# Altium schematic sheet SheetMicrocontroller.SchDoc
size A3; DocumentNumber: 3; SheetNumber: 3; SheetTotal: 5
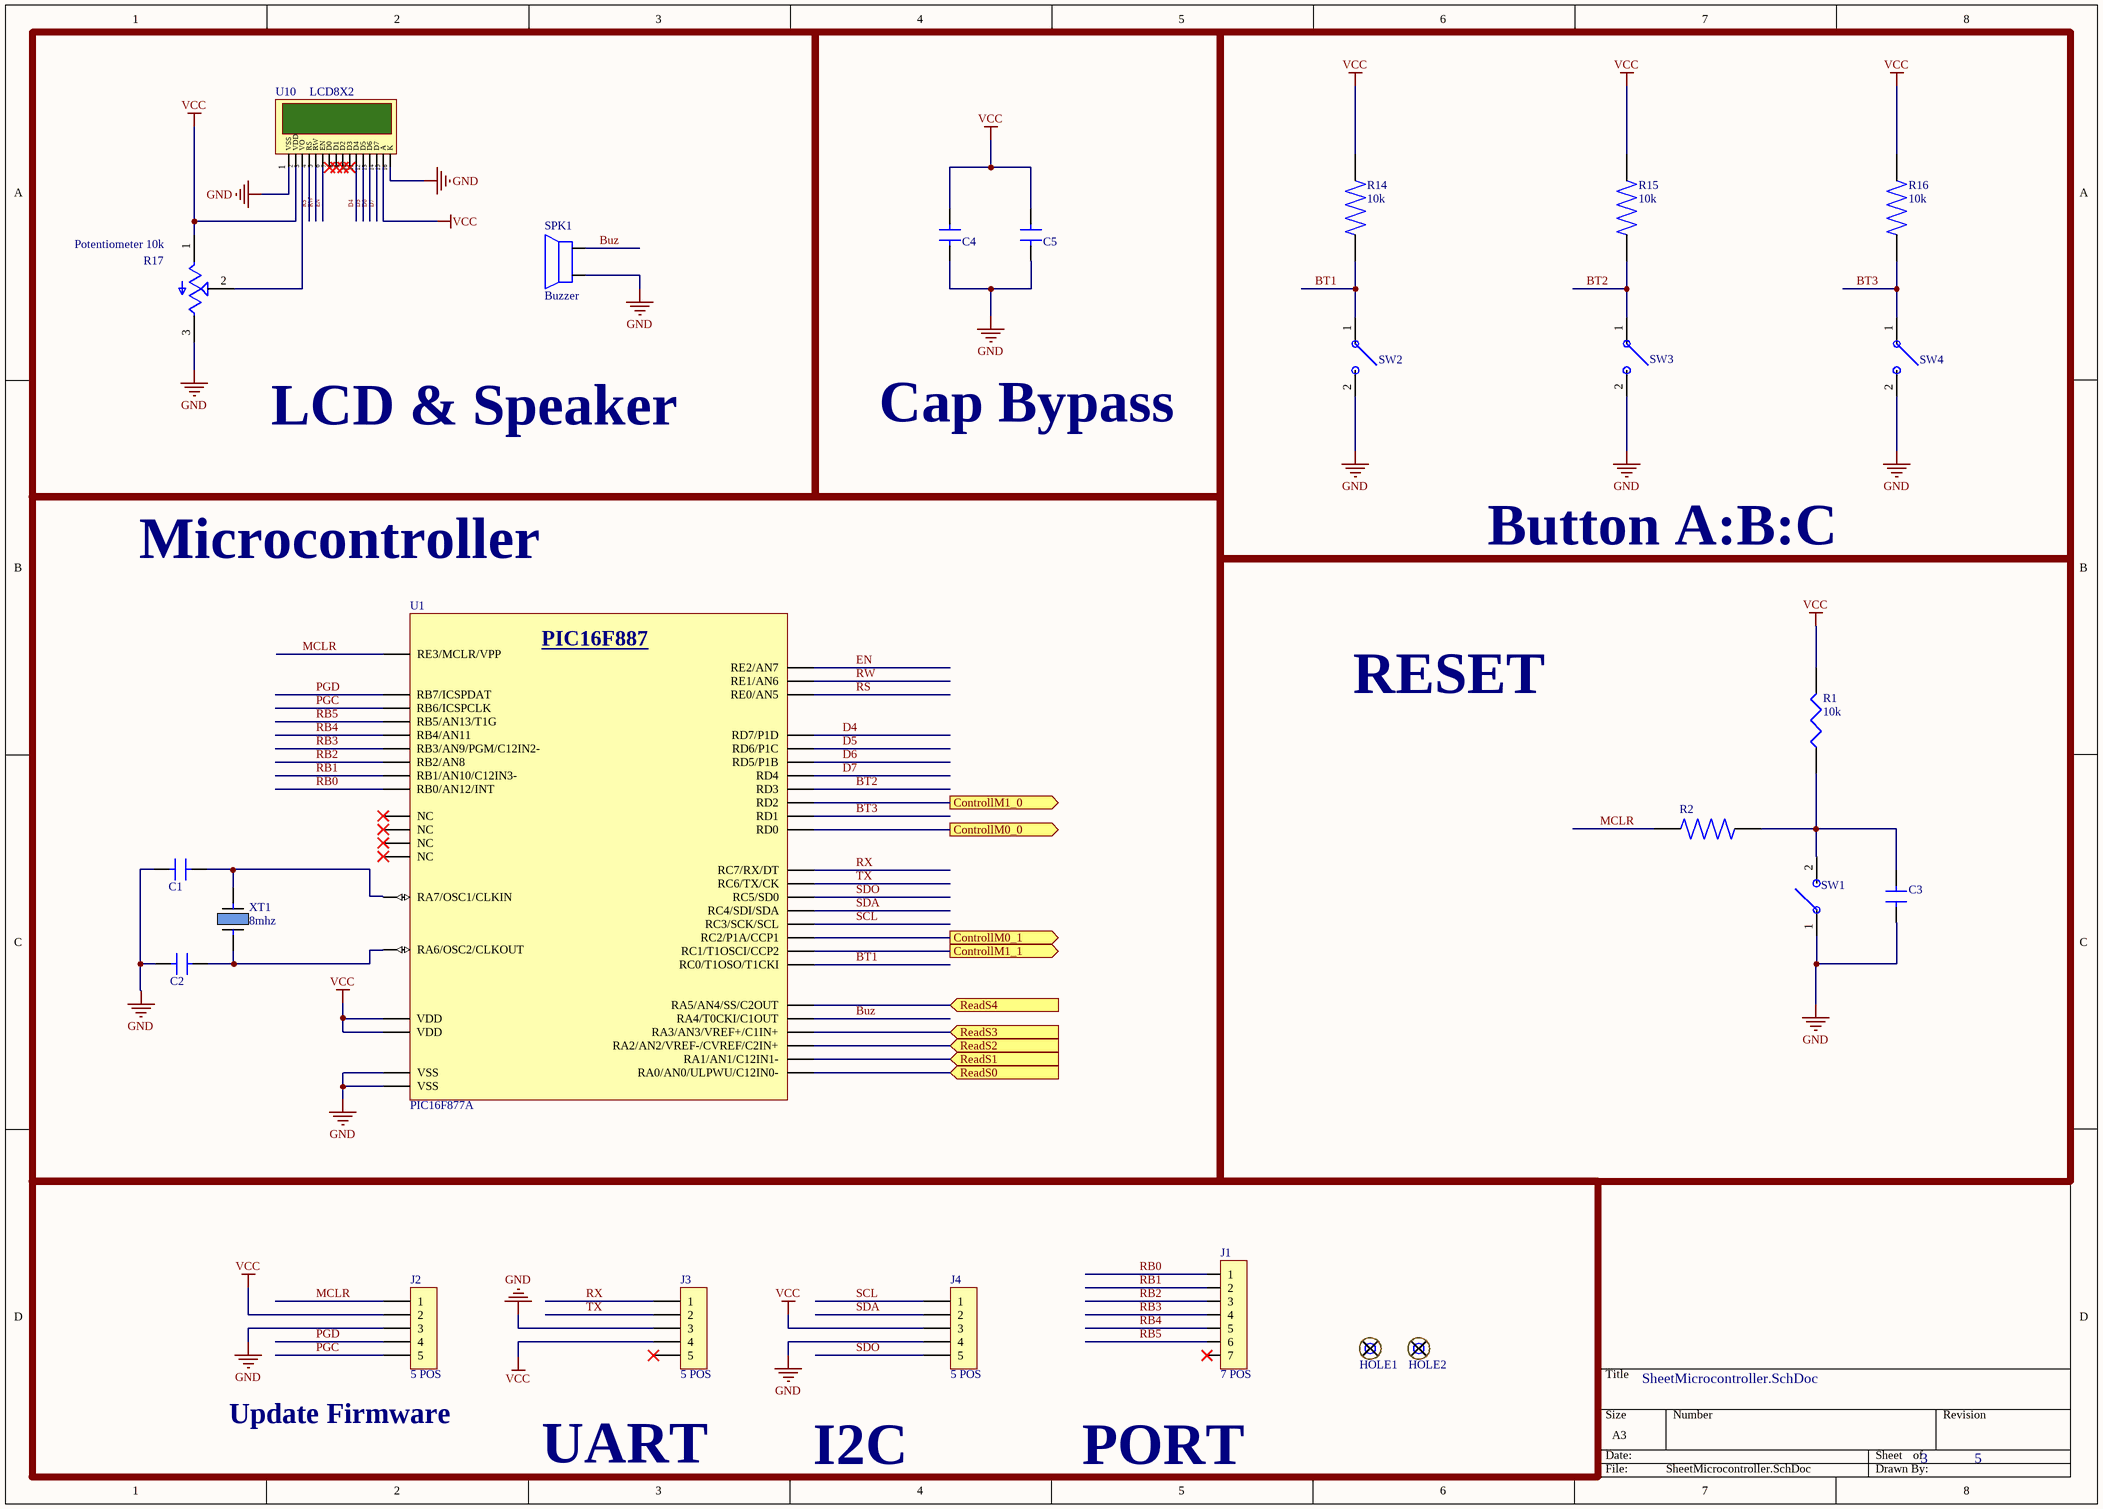
[diagram p0: SheetMicrocontroller.SchDoc]

## Parts
C1  30PF 50V  [C0805 30PF 50V]  (value not drawn)
C2  30PF 50V  [C0805 30PF 50V]  (value not drawn)
C3  C0805C104K5RACTU  [CAP104 0.1UF 50V]  (value not drawn)
C4  C0805C104K5RACTU  [CAP104 0.1UF 50V]  (value not drawn)
C5  C0805C104K5RACTU  [CAP104 0.1UF 50V]  (value not drawn)
HOLE1  Hole  [Hole 2MM]  (value not drawn)
HOLE2  Hole  [Hole 2MM]  (value not drawn)
J1  7 POS  [CONN HEADER VERT 7POS 2.54MM]
J2  5 POS  [CONN HEADER VERT 5POS 2.54MM]
J3  5 POS  [CONN HEADER VERT 5POS 2.54MM]
J4  5 POS  [CONN HEADER VERT 5POS 2.54MM]
R1  10k  [RC0805 10K OHM 1% 1/8W]
R2  RC0805JR-07470RL  [RC0805JR-07470RL]  (value not drawn)
R14  10k  [RC0805 10K OHM 1% 1/8W]
R15  10k  [RC0805 10K OHM 1% 1/8W]
R16  10k  [RC0805 10K OHM 1% 1/8W]
R17  Potentiometer 10k  [TRIM_TC33X-2-103E]
SPK1  Buzzer  [BUZZER]
SW1  PTS636SM43JSMTRLFS  [PTS636 SM43J SMTR LFS]  (value not drawn)
SW2  PTS636SM43JSMTRLFS  [PTS636 SM43J SMTR LFS]  (value not drawn)
SW3  PTS636SM43JSMTRLFS  [PTS636 SM43J SMTR LFS]  (value not drawn)
SW4  PTS636SM43JSMTRLFS  [PTS636 SM43J SMTR LFS]  (value not drawn)
U1  PIC16F877A  [TQFP80P1200X1200X120-44N]
U10  LCD8X2  [LCD0802]
XT1  8mhz  [CAPAE13348X42M]

## Blocks framed on the sheet
LCD & Speaker: R17 SPK1 U10
Cap Bypass: C4 C5
Button A:B:C: R14-R16 SW2-SW4
Microcontroller: C1 C2 U1 XT1
RESET: C3 R1 R2 SW1

## Ports
ControllM0_0 (out), ControllM0_1 (out), ControllM1_0 (out), ControllM1_1 (out), ReadS0 (in), ReadS1 (in), ReadS2 (in), ReadS3 (in), ReadS4 (in)

## Nets
GND: C1.1 C2.1 C3.1 C4.1 C5.1 J2.3 J3.3 J4.4 R17.3(CW) SPK1.2 SW1.1 SW2.2 SW3.2 SW4.2 U1.6(VSS) U1.29(VSS) U10.1(VSS) U10.16(K)
VCC: C4.2 C5.2 J2.2 J3.4 J4.3 R1.2 R14.2 R15.2 R16.2 R17.1(CCW) U1.7(VDD) U1.28(VDD) U10.2(VDD) U10.15(A)
BT1: R14.1 SW2.1 U1.32(RC0/T1OSO/T1CKI)
BT2: R15.1 SW3.1 U1.41(RD3)
BT3: R16.1 SW4.1 U1.39(RD1)
Buz: SPK1.1 U1.23(RA4/T0CKI/C1OUT)
ControllM0_0: U1.38(RD0) ; port ControllM0_0
ControllM0_1: U1.36(RC2/P1A/CCP1) ; port ControllM0_1
ControllM1_0: U1.40(RD2) ; port ControllM1_0
ControllM1_1: U1.35(RC1/T1OSCI/CCP2) ; port ControllM1_1
D4: U1.5(RD7/P1D) U10.11(D4)
D5: U1.4(RD6/P1C) U10.12(D5)
D6: U1.3(RD5/P1B) U10.13(D6)
D7: U1.2(RD4) U10.14(D7)
EN: U1.27(RE2/AN7) U10.6(EN)
MCLR: J2.1 R2.1 U1.18(RE3/MCLR/VPP)
PGC: J2.5 U1.16(RB6/ICSPCLK)
PGD: J2.4 U1.17(RB7/ICSPDAT)
RB0: J1.1 U1.8(RB0/AN12/INT)
RB1: J1.2 U1.9(RB1/AN10/C12IN3-)
RB2: J1.3 U1.10(RB2/AN8)
RB3: J1.4 U1.11(RB3/AN9/PGM/C12IN2-)
RB4: J1.5 U1.14(RB4/AN11)
RB5: J1.6 U1.15(RB5/AN13/T1G)
ReadS0: U1.19(RA0/AN0/ULPWU/C12IN0-) ; port ReadS0
ReadS1: U1.20(RA1/AN1/C12IN1-) ; port ReadS1
ReadS2: U1.21(RA2/AN2/VREF-/CVREF/C2IN+) ; port ReadS2
ReadS3: U1.22(RA3/AN3/VREF+/C1IN+) ; port ReadS3
ReadS4: U1.24(RA5/AN4/SS/C2OUT) ; port ReadS4
RS: U1.25(RE0/AN5) U10.4(RS)
RW: U1.26(RE1/AN6) U10.5(RW)
RX: J3.1 U1.1(RC7/RX/DT)
SCL: J4.1 U1.37(RC3/SCK/SCL)
SDA: J4.2 U1.42(RC4/SDI/SDA)
SDO: J4.5 U1.43(RC5/SD0)
TX: J3.2 U1.44(RC6/TX/CK)
NetC1_2: C1.2 U1.30(RA7/OSC1/CLKIN) XT1.2
NetC2_2: C2.2 U1.31(RA6/OSC2/CLKOUT) XT1.1
NetC3_2: C3.2 R1.1 R2.2 SW1.2
NetR17_2: R17.2(W) U10.3(VO)

Not connected (* = marked no-connect by the designer): J1 7*; J3 5*; U1 12(NC)* 13(NC)* 33(NC)* 34(NC)*; U10 7(D0)* 8(D1)* 9(D2)* 10(D3)*

## Notes on the sheet
- (near J2) Update Firmware
- UART
- I2C
- PORT
- (in symbol PIC16F887-I/PT) PIC16F887

## Library data of the parts
C1 C2 = C0805X300J5GAC7800: Manufacturer: KEMET; Supplier 1: Digi-Key; Manufacturer Part Number: C0805X300J5GAC7800; Stock 1: 3943; Pricing 1: 1 = 0.42000, 10 = 0.29100, 50 = 0.20380, 100 = 0.17460, 500 = 0.13098, 1000 = 0.11060 (USD); RoHS: No; Supplier Part Number 1: 399-19459-1-ND
C3-C5 = C0805C104K5RACTU: Cap Ceramic 0.1uF 50V X7R 10% SMD 2.0 x 1.2 mm 125 C Paper T/R; Manufacturer: KEMET; Capacitance: 100nF; Voltage: 500V; Supplier 1: Digi-Key; Manufacturer Part Number: C0805C104K5RACTU; Stock 1: 2487008; Pricing 1: 1 = 0.16000, 10 = 0.11500, 50 = 0.06540, 100 = 0.05420, 500 = 0.03802, 1000 = 0.03147 (USD); RoHS: Yes; Mount: Surface Mount,PCB; Case/Package: 0805; Number of Pins: 2; Dielectric Material: Ceramic; Case Code (Imperial): 0805; Case Code (Metric): 2012; Contact Plating: Tin,Matte; Min Operating Temperature: -55°C; Max Operating Temperature: 125°C; Tolerance: 10%; Packaging: Tape and Reel; Voltage Rating (DC): 50V; Dielectric: X7R; Termination: SMD/SMT; Package Quantity: 4000; Voltage Rating: 50V; Length: 2mm; Height: 0.9mm; Width: 1.2mm; Lead Pitch: 0.75mm; Depth: 1.25mm; Thickness: 0.035inch; Radiation Hardening: No; REACH SVHC: No SVHC; ComponentLink1URL: https://datasheet.ciiva.com/14589/70095383-14589048.pdf?src-supplier=Allied+Electronics; ComponentLink1Description: https://datasheet.ciiva.com/14589/70095383-14589048.pdf?src-supplier=Allied+Electronics; ComponentLink2URL: https://datasheet.ciiva.com/28682/1851736-28682232.pdf?src-supplier=Element14; ComponentLink2Description: https://datasheet.ciiva.com/28682/1851736-28682232.pdf?src-supplier=Element14; ComponentLink3URL: https://datasheet.ciiva.com/32431/slceramic-chip-condensers-e-32431755.pdf?src-supplier=Distrelec; ComponentLink3Description: https://datasheet.ciiva.com/32431/slceramic-chip-condensers-e-32431755.pdf?src-supplier=Distrelec; ComponentLink4URL: https://datasheet.ciiva.com/18410/70095383-18410815.pdf?src-supplier=Allied+Electronics; ComponentLink4Description: https://datasheet.ciiva.com/18410/70095383-18410815.pdf?src-supplier=Allied+Electronics; Supplier Part Number 1: 399-1170-1-ND
HOLE1 HOLE2 = Hole 2mm: Hole 3mm
J1 = 0022284074: Header Connector, Pcb Mount, Recept, 7 Contacts, Pin, 0.1 Pitch, Pc Tail Terminal; Manufacturer: Molex; Contact Resistance: 20mR; Number of Positions: 7; Gender: Male; Connector Type: Male Pin; Max Voltage Rating (AC): 250V; Pitch: 2.54mm; Supplier 1: Digi-Key; Manufacturer Part Number: 0022284074; Stock 1: 3294; Pricing 1: 1 = 0.63000, 10 = 0.53100, 100 = 0.41300 (USD); RoHS: Yes; Mount: Through Hole; Contact Plating: Gold; Contact Material: Bronze; Color: Black; Housing Color: Black; Housing Material: Thermoplastic; Min Operating Temperature: 0°C; Max Operating Temperature: 75°C; Number of Rows: 1; Packaging: Bulk; Termination: Solder; Number of Contacts: 7; Orientation: Straight; Package Quantity: 1; Series: KK® 42375; Contact Type: Male Pin; Length: 17.78mm; Depth: 2.49mm; Contact Mating Length: 0.32inch; RoHS Compliant: Yes; ComponentLink1URL: https://datasheet.ciiva.com/6814/022284363-sd-6814049.pdf?src-supplier=Digi-Key; ComponentLink1Description: https://datasheet.ciiva.com/6814/022284363-sd-6814049.pdf?src-supplier=Digi-Key; ComponentLink2URL: https://datasheet.ciiva.com/10087/0022284074-pcb-headers-10087690.pdf?src-supplier=Avnet; ComponentLink2Description: https://datasheet.ciiva.com/10087/0022284074-pcb-headers-10087690.pdf?src-supplier=Avnet; Supplier Part Number 1: WM50018-07-ND
J2-J4 = PRPC005SACN-RC: Conn Header Vert 5POS 2.54MM; Manufacturer: Sullins; Number of Positions: 5; Connector Type: Male Pin; Pitch: 0.1inch; Supplier 1: Digi-Key; Manufacturer Part Number: PRPC005SACN-RC; Stock 1: 0; Pricing 1: 1 = 0.21000, 10 = 0.19600, 25 = 0.16760, 50 = 0.14660, 100 = 0.13610, 250 = 0.12040, 500 = 0.11518 (USD); RoHS: Yes; Mount: Through Hole; Contact Plating: Gold; Color: Black; Package Quantity: 1; Termination: Solder; Number of Rows: 1; Packaging: Bulk; Contact Mating Length: 0.23inch; ComponentLink1URL: https://datasheet.ciiva.com/741/xrxczzzsxxn-rc-st-11635-b-741960.pdf?src-supplier=Digi-Key; ComponentLink1Description: https://datasheet.ciiva.com/741/xrxczzzsxxn-rc-st-11635-b-741960.pdf?src-supplier=Digi-Key; Supplier Part Number 1: S1131EC-05-ND
R1 R14-R16 = RC0805FR-0710KL: RES SMD 10K OHM 1% 1/8W 0805; Manufacturer: Yageo; Resistance: 10kR; Temperature Coefficient: 100ppm/°C; Power Rating: 125mW; Voltage Rating: 150V; Supplier 1: Digi-Key; Manufacturer Part Number: RC0805FR-0710KL; Stock 1: 18880636; Pricing 1: 1 = 0.10000, 10 = 0.03900, 100 = 0.01570, 1000 = 0.00705, 2500 = 0.00612 (USD); RoHS: Yes; Case/Package: 0805; Case Code (Imperial): 0805; Case Code (Metric): 2012; Min Operating Temperature: -55°C; Max Operating Temperature: 155°C; Packaging: Tape and Reel; Tolerance: 1%; Composition: Thick Film; Package Quantity: 1; Termination: SMD/SMT; Number of Terminations: 2; Military Standard: Not; Max Power Dissipation: 125mW; Features: Moisture Resistant; Length: 2mm; Height: 0.024inch; Width: 0.049inch; Depth: 1.25mm; REACH SVHC: Unknown; Lead Free: Lead Free; ComponentLink1URL: https://datasheet.ciiva.com/11808/0900766b8106beab-11808151.pdf?src-supplier=RSComponents; ComponentLink1Description: https://datasheet.ciiva.com/11808/0900766b8106beab-11808151.pdf?src-supplier=RSComponents; ComponentLink2URL: https://datasheet.ciiva.com/12669/rc0805-12669688.pdf?src-supplier=Mouser; ComponentLink2Description: https://datasheet.ciiva.com/12669/rc0805-12669688.pdf?src-supplier=Mouser; ComponentLink3URL: https://datasheet.ciiva.com/46447/444164-46447563.pdf?src-supplier=Element14; ComponentLink3Description: https://datasheet.ciiva.com/46447/444164-46447563.pdf?src-supplier=Element14; ComponentLink4URL: https://datasheet.ciiva.com/2456/pyu-r-int-thick-7-2456972.pdf?src-supplier=Digi-Key; ComponentLink4Description: https://datasheet.ciiva.com/2456/pyu-r-int-thick-7-2456972.pdf?src-supplier=Digi-Key; ComponentLink5URL: https://datasheet.ciiva.com/2456/pyu-r-int-thick-7-2456973.pdf?src-supplier=Digi-Key; ComponentLink5Description: https://datasheet.ciiva.com/2456/pyu-r-int-thick-7-2456973.pdf?src-supplier=Digi-Key; ComponentLink6URL: https://datasheet.ciiva.com/2456/pyu-r-int-thick-7-2456974.pdf?src-supplier=Digi-Key; ComponentLink6Description: https://datasheet.ciiva.com/2456/pyu-r-int-thick-7-2456974.pdf?src-supplier=Digi-Key; ComponentLink7URL: https://datasheet.ciiva.com/16747/rc0805-16747087.pdf?src-supplier=Future+Electronics; ComponentLink7Description: https://datasheet.ciiva.com/16747/rc0805-16747087.pdf?src-supplier=Future+Electronics; Supplier Part Number 1: 311-10.0KCRCT-ND
R2 = RC0805JR-07470RL: RES SMD 470 OHM 5% 1/8W 0805; Manufacturer: Yageo Phycomp; Power Rating: 125mW; Resistance: 470R; Voltage Rating (DC): 150V; Supplier 1: Digi-Key; Manufacturer Part Number: RC0805JR-07470RL; Stock 1: 893456; Pricing 1: 1 = 0.10000, 10 = 0.03300, 100 = 0.01350, 1000 = 0.00607, 2500 = 0.00527 (USD); RoHS: No; Case/Package: 0805; Number of Pins: 2; Packaging: Cut Tape; Tolerance: 5%; Length: 2mm; Height: 500um; Width: 1.25mm; REACH SVHC: No SVHC; Lead Free: Lead Free; ComponentLink1URL: http://www.farnell.com/datasheets/2167052.pdf?src-supplier=Farnell; ComponentLink1Description: http://www.farnell.com/datasheets/2167052.pdf?src-supplier=Farnell; ComponentLink2URL: http://www.yageo.com/documents/recent/PYu-RC_Group_51_RoHS_L_9.pdf?src-supplier=Digi-Key; ComponentLink2Description: http://www.yageo.com/documents/recent/PYu-RC_Group_51_RoHS_L_9.pdf?src-supplier=Digi-Key; ComponentLink3URL: http://www.yageo.com.tw/exep/pages/download/literatures/PYu-R_INT-thick_7.pdf?src-supplier=Digi-Key; ComponentLink3Description: http://www.yageo.com.tw/exep/pages/download/literatures/PYu-R_INT-thick_7.pdf?src-supplier=Digi-Key; ComponentLink4URL: http://www.yageo.com/documents/recent/PYu-RC_Group_51_RoHS_L_10.pdf?src-supplier=Digi-Key; ComponentLink4Description: http://www.yageo.com/documents/recent/PYu-RC_Group_51_RoHS_L_10.pdf?src-supplier=Digi-Key; Supplier Part Number 1: 311-470ARCT-ND
R17 = TC33X-2-103E: 10 kOhms 0.1W, 1/10W J Lead Surface Mount Trimmer Potentiometer Cermet 1 Turn Top Adjustment; MF: Bourns; MP: TC33X-2-103E; SnapEDA_Link: https://www.snapeda.com/parts/TC33X-2-103E/Bourns/view-part/47092/?ref=snap; Package: SOD-23 Bourns; Check_prices: https://www.snapeda.com/parts/TC33X-2-103E/Bourns/view-part/47092/?ref=eda; Value: *; Purchase-URL: https://pricing.snapeda.com/search/part/TC33X-2-103E/?ref=eda; Digi-Key_Part_Number: TC33X-103ECT-ND
SPK1 = AT-1224-TWT-5V-2-R: AUDIO MAGNETIC XDCR 3-7V TH; Manufacturer: Projects Unlimited; Voltage Rating: 5V; Frequency: 2.4kHz; Operating Supply Current: 40mA; Supplier 1: Digi-Key; Manufacturer Part Number: AT-1224-TWT-5V-2-R; Stock 1: 74588; Pricing 1: 1 = 0.61000, 10 = 0.52000, 25 = 0.48640, 40 = 0.46125, 100 = 0.43680, 500 = 0.38252, 1000 = 0.36032, 4900 = 0.31168 (USD); RoHS: Yes; Mount: Through Hole; Contact Plating: Tin; Min Operating Temperature: -30°C; Max Operating Temperature: 70°C; Packaging: Tray; Termination: PC Pins; Sensing Method: Magnetic; Max Supply Current: 40mA; Diameter: 12mm; Height: 9mm; ComponentLink1URL: http://www.mouser.com/ds/2/334/AT-1224-TWT-5V-2-R-532234.pdf?src-supplier=Mouser; ComponentLink1Description: http://www.mouser.com/ds/2/334/AT-1224-TWT-5V-2-R-532234.pdf?src-supplier=Mouser; ComponentLink2URL: http://www.puiaudio.com/pdf/AT-1224-TWT-5V-2-R.pdf?src-supplier=Digi-Key; ComponentLink2Description: http://www.puiaudio.com/pdf/AT-1224-TWT-5V-2-R.pdf?src-supplier=Digi-Key; ComponentLink3URL: http://www.puiaudio.com/pdf/AT-1224-TWT-5V-2-R.pdf?src-supplier=Avnet; ComponentLink3Description: http://www.puiaudio.com/pdf/AT-1224-TWT-5V-2-R.pdf?src-supplier=Avnet; Supplier Part Number 1: 668-1470-ND
SW1-SW4 = PTS636SM43JSMTRLFS: Switch Reset; Manufacturer: ITT C&K; Supplier 1: Digi-Key; Manufacturer Part Number: PTS636SM43JSMTRLFS; Stock 1: 0; RoHS: No; Supplier Part Number 1: CKN12317-1-ND
U1 = PIC16F887-I/PT: IC, MCU 8BIT 14K FLASH, SMD, TQFP44; Controller Family/Series:PIC16F8xxx; Program Memory Size:14KB; RAM Memory Size:368Byte; CPU Speed:20MHz; No. of I/Os:35; Digital IC Case Style:TQFP; No. of Pins:44; Embedded Interface ;RoHS Compliant: Yes; Manufacturer: Microchip; RAM Size: 368B; Number of I/Os: 35; Number of Timers/Counters: 3; Max Supply Voltage: 5.5V; Min Supply Voltage: 2V; Interface: I2C,SPI,UART,USART; Number of PWM Channels: 5; Max Power Dissipation: 800mW; Number of ADC Channels: 14; Frequency: 20MHz; Density: 14KB; Number of UART Channels: 1; Number of Programmable I/O: 36; Data Bus Width: 8b; Number of Bits: 8; Oscillator Type: Internal; Nominal Supply Current: 220uA; Access Time: 20us; Peripherals: PWM,Brown-out Detect/Reset,POR,WDT,I2C; Core Architecture: PIC; Supplier 1: Digi-Key; Manufacturer Part Number: PIC16F887-I/PT; Stock 1: 629; Pricing 1: 1 = 2.35000, 25 = 2.29000, 100 = 2.23000 (USD); RoHS: Yes; Mount: Surface Mount; Case/Package: TQFP; Number of Pins: 44; Min Operating Temperature: -40°C; Max Operating Temperature: 85°C; Package Quantity: 160; Packaging: Tray; Termination: SMD/SMT; Memory Type: FLASH; Number of A/D Converters: 1; Max Frequency: 20MHz; Number of SPI Channels: 1; Number of I2C Channels: 1; Address Bus Width: 8b; Watchdog Timer: Yes; Memory Size: 14KB; Length: 10mm; Height: 1.05mm; Width: 10mm; Radiation Hardening: No; REACH SVHC: No SVHC; Lead Free: Lead Free; ComponentLink1URL: https://datasheet.ciiva.com/6149/41291f-6149840.pdf?src-supplier=Farnell; ComponentLink1Description: https://datasheet.ciiva.com/6149/41291f-6149840.pdf?src-supplier=Farnell; ComponentLink2URL: https://datasheet.ciiva.com/29119/160450-da-01-en-pic-pic16f887-i-pt-29119396.pdf?src-supplier=Conrad; ComponentLink2Description: https://datasheet.ciiva.com/29119/160450-da-01-en-pic-pic16f887-i-pt-29119396.pdf?src-supplier=Conrad; ComponentLink3URL: https://datasheet.ciiva.com/7892/41291f-7892232.pdf?src-supplier=Element14; ComponentLink3Description: https://datasheet.ciiva.com/7892/41291f-7892232.pdf?src-supplier=Element14; ComponentLink4URL: https://datasheet.ciiva.com/20167/73-3716-20167960.pdf?src-supplier=Rapid+Electronics; ComponentLink4Description: https://datasheet.ciiva.com/20167/73-3716-20167960.pdf?src-supplier=Rapid+Electronics; ComponentLink5URL: https://datasheet.ciiva.com/7892/1681365-7892233.pdf?src-supplier=Element14; ComponentLink5Description: https://datasheet.ciiva.com/7892/1681365-7892233.pdf?src-supplier=Element14; ComponentLink6URL: https://datasheet.ciiva.com/16211/filehandler-aspxddocname-en027084-16211484.pdf?src-supplier=Future+Electronics; ComponentLink6Description: https://datasheet.ciiva.com/16211/filehandler-aspxddocname-en027084-16211484.pdf?src-supplier=Future+Electronics; ComponentLink7URL: https://datasheet.ciiva.com/1489/41291g-1489550.pdf?src-supplier=Digi-Key; ComponentLink7Description: https://datasheet.ciiva.com/1489/41291g-1489550.pdf?src-supplier=Digi-Key; ComponentLink8URL: https://datasheet.ciiva.com/3203/41291f-3203503.pdf?src-supplier=Avnet; ComponentLink8Description: https://datasheet.ciiva.com/3203/41291f-3203503.pdf?src-supplier=Avnet; ComponentLink9URL: https://datasheet.ciiva.com/17232/41291f-17232831.pdf?src-supplier=Avnet+Europe; ComponentLink9Description: https://datasheet.ciiva.com/17232/41291f-17232831.pdf?src-supplier=Avnet+Europe; Supplier Part Number 1: PIC16F887-I/PT-ND
U10 = LCD0821: LCD ALPHA/NUM DISPL 8X2 YW/GN BK; Manufacturer: Matrix Orbital; Interface: I2C,RS-232; Background Color: Green; Number of Characters: 16; Backlight Type: LED; Supplier 1: Digi-Key; Manufacturer Part Number: LCD0821; Stock 1: 244; Pricing 1: 1 = 39.95000, 25 = 39.00000, 50 = 38.03020, 100 = 36.08030, 200 = 34.68750 (USD); RoHS: Yes; Min Operating Temperature: 0°C; Max Operating Temperature: 50°C; Packaging: Bulk; Package Quantity: 1; Length: 58mm; Width: 32mm; Height: 25mm; Lead Free: Lead Free; ComponentLink1URL: https://datasheet.ciiva.com/2102/lcd082120technical20manual-2102303.pdf?src-supplier=Digi-Key; ComponentLink1Description: https://datasheet.ciiva.com/2102/lcd082120technical20manual-2102303.pdf?src-supplier=Digi-Key; Supplier Part Number 1: 635-1009-ND
XT1 = ABLS-8.000MHZ-K4T: ABRACON         ABLS-8.000MHZ-K4T             CRYSTAL, 8MHZ, 18PF, HC-49US; Frequency Stability: 50ppm; Series Resistance: 80R; Frequency Tolerance: 30ppm; Supplier 1: Digi-Key; Manufacturer: Abracon; Manufacturer Part Number: ABLS-8.000MHZ-K4T; Stock 1: 69433; Pricing 1: 1 = 0.74000, 10 = 0.65600, 50 = 0.61300, 100 = 0.54170, 500 = 0.51322 (USD); RoHS: Yes; Mount: Surface Mount; Case/Package: SMD/SMT; Min Operating Temperature: -40°C; Max Operating Temperature: 125°C; Termination: SMD/SMT; Package Quantity: 1000; Frequency: 8MHz; Load Capacitance: 18pF; ESR (Equivalent Series Resistance): 80R; Packaging: Tape and Reel; Tolerance: 30ppm; Length: 11.4mm; Height: 0.165inch; Depth: 4.7mm; Width: 0.185inch; Radiation Hardening: No; REACH SVHC: Yes; Lead Free: Lead Free; ComponentLink1URL: https://datasheet.ciiva.com/860/abls-860577.pdf?src-supplier=Digi-Key; ComponentLink1Description: https://datasheet.ciiva.com/860/abls-860577.pdf?src-supplier=Digi-Key; ComponentLink2URL: https://datasheet.ciiva.com/16423/abls-16423596.pdf?src-supplier=Future+Electronics; ComponentLink2Description: https://datasheet.ciiva.com/16423/abls-16423596.pdf?src-supplier=Future+Electronics; ComponentLink3URL: https://datasheet.ciiva.com/860/abls-860575.pdf?src-supplier=Digi-Key; ComponentLink3Description: https://datasheet.ciiva.com/860/abls-860575.pdf?src-supplier=Digi-Key; ComponentLink4URL: https://datasheet.ciiva.com/860/abls-860576.pdf?src-supplier=Digi-Key; ComponentLink4Description: https://datasheet.ciiva.com/860/abls-860576.pdf?src-supplier=Digi-Key; ComponentLink5URL: https://datasheet.ciiva.com/3175/abls-3175447.pdf?src-supplier=Avnet; ComponentLink5Description: https://datasheet.ciiva.com/3175/abls-3175447.pdf?src-supplier=Avnet; ComponentLink6URL: https://datasheet.ciiva.com/4945/abls-44621-4945022.pdf?src-supplier=Mouser; ComponentLink6Description: https://datasheet.ciiva.com/4945/abls-44621-4945022.pdf?src-supplier=Mouser; Supplier Part Number 1: 535-9937-1-ND